# EAGLE design bq24026 USB (EAGLE 6.1)
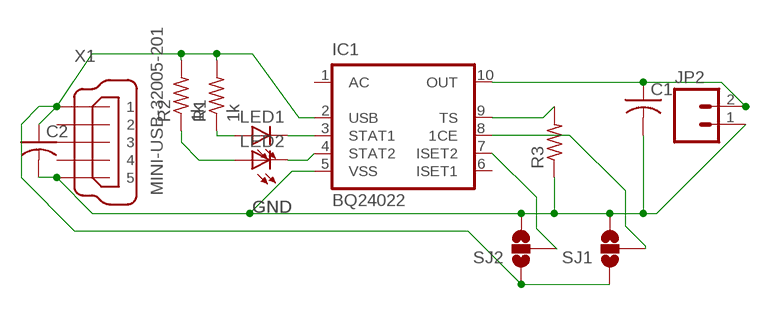
[diagram p0: schematic, sheet 1]

## Parts
C1  C-USC0805K  [C0805K]
C2  C-USC0805K  [C0805K]
IC1  BQ24022  [DRC-S-PVSON-N10]
JP2  M02  [1X02_LONGPADS]
LED1  LEDCHIPLED_0805  [CHIPLED_0805]
LED2  LEDCHIPLED_0805  [CHIPLED_0805]
R1  1k  R-US_M0805  [M0805]
R2  1k  R-US_M0805  [M0805]
R3  R-US_M1206  [M1206]
SJ1  SOLDERJUMPER_2WAYS  [SJ_3]
SJ2  SOLDERJUMPER_2WAYS  [SJ_3]
X1  MINI-USB-32005-201  [32005-201]

## Nets
GND: C1.2 C2.2 IC1.5(VSS) JP2.1 R3.1 SJ1.3 SJ2.3 X1.5
N$1: IC1.9(TS) R3.2
N$2: C2.1 IC1.2(USB) R1.2 R2.2 X1.1
N$3: LED1.A R1.1
N$4: LED2.A R2.1
N$5: IC1.3(STAT1) LED1.C
N$6: IC1.4(STAT2) LED2.C
N$7: IC1.7(ISET2) SJ2.2
N$8: C1.1 IC1.10(OUT) JP2.2
N$9: IC1.8(1CE) SJ1.2
N$10: SJ1.1 SJ2.1
Unconnected: IC1.1(AC) IC1.6(ISET1) IC1.TH X1.2 X1.3 X1.4

## Library data of the parts
C1 C2 = resistor:C-US: CAPACITOR, American symbol
IC1 = texas:BQ24022: SINGLE-CHIP, LI-ION AND LI-POL CHARGER IC WITH AUTONOMOUS USB-PORT AND AC-ADAPTER SUPPLY MANAGEMENT (bqTINY™-II) Source: bq24022.pdf (www.ti.com)
JP2 = SparkFun:M02: Header 2 Standard 2-pin 0.1" header. Use with straight break away headers (SKU : PRT-00116), right angle break away headers (PRT-00553), swiss pins (PRT-00743), machine pins (PRT-00117), and female headers (PRT-00115). Molex polarized connector foot print use with SKU : PRT-08233 with associated crimp pins and housings.
LED1 LED2 = led:LED: LED OSRAM: - CHIPLED LG R971, LG N971, LY N971, LG Q971, LY Q971, LO R971, LY R971 LH N974, LH R974 LS Q976, LO Q976, LY Q976 LO Q996 - Hyper CHIPLED LW Q18S LB Q993, LB Q99A, LB R99A - SideLED LS A670, LO A670, LY A670, LG A670, LP A670 LB A673, LV A673, LT A673, LW A673 LH A674 LY A675 LS A676, LA A676, LO A676, LY A676, LW A676 LS A679, LY A679, LG A679 - Hyper Micro SIDELED® LS Y876, LA Y876, LO Y876, LY Y876 LT Y87S - SmartLED LW L88C, LW L88S LB L89C, LB L89S, LG L890 LS L89K, LO L89K, LY L89K LS L896, LA L896, LO L896, LY L896 - TOPLED LS T670, LO T670, LY T670, LG T670, LP T670 LSG T670, LSP T670, LSY T670, LOP T670, LYG T670 LG T671, LOG T671, LSG T671 LB T673, LV T673, LT T673, LW T673 LH T674 LS T676, LA T676, LO T676, LY T676, LB T676, LH T676, LSB T676, LW T676 LB T67C, LV T67C, LT T67C, LS T67K, LO T67K, LY T67K, LW E67C LS E67B, LA E67B, LO E67B, LY E67B, LB E67C, LV E67C, LT E67C LW T67C LS T679, LY T679, LG T679 LS T770, LO T770, LY T770, LG T770, LP T770 LB T773, LV T773, LT T773, LW T773 LH T774 LS E675, LA E675, LY E675, LS T675 LS T776, LA T776, LO T776, LY T776, LB T776 LHGB T686 LT T68C, LB T68C - Hyper Mini TOPLED® LB M676 - Mini TOPLED Santana® LG M470 LS M47K, LO M47K, LY M47K Source: http://www.osram.convergy.de LUXEON: - LUMILED® LXK2-PW12-R00, LXK2-PW12-S00, LXK2-PW14-U00, LXK2-PW14-V00 LXK2-PM12-R00, LXK2-PM12-S00, LXK2-PM14-U00 LXK2-PE12-Q00, LXK2-PE12-R00, LXK2-PE12-S00, LXK2-PE14-T00, LXK2-PE14-U00 LXK2-PB12-K00, LXK2-PB12-L00, LXK2-PB12-M00, LXK2-PB14-N00, LXK2-PB14-P00, LXK2-PB14-Q00 LXK2-PR12-L00, LXK2-PR12-M00, LXK2-PR14-Q00, LXK2-PR14-R00 LXK2-PD12-Q00, LXK2-PD12-R00, LXK2-PD12-S00 LXK2-PH12-R00, LXK2-PH12-S00 LXK2-PL12-P00, LXK2-PL12-Q00, LXK2-PL12-R00 Source: www.luxeon.com KINGBRIGHT: KA-3528ASYC Source: www.kingbright.com
R1-R3 = resistor:R-US_: RESISTOR, American symbol
SJ1 SJ2 = SparkFun:SOLDERJUMPER_2WAY: Solder Jumper 2 way solder jumper
X1 = con-cypressindustries:MINI-USB-: MINI USB-B Conector Source: www.cypressindustries.com; OC_FARNELL: unknown; OC_NEWARK: unknown

## Board
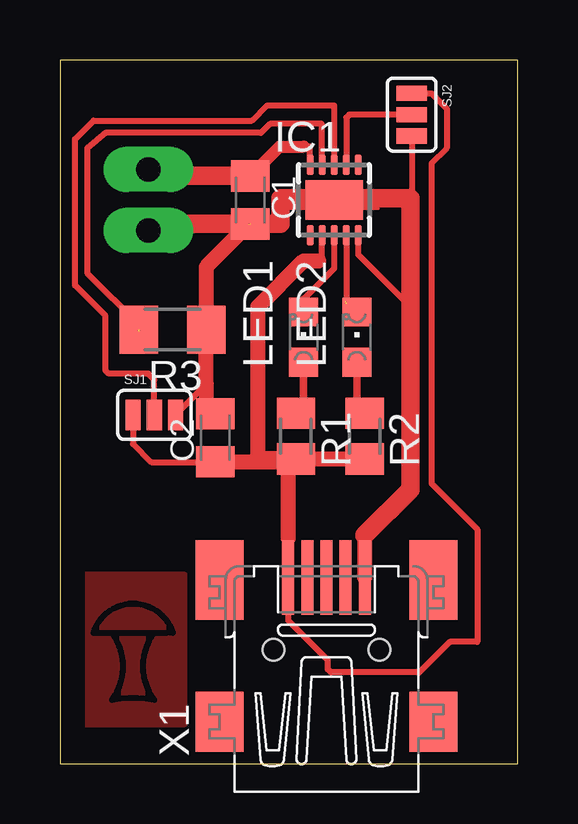
[diagram p1: board, top side]

Size 19.1 x 29.33 mm. Coordinates in mm from the lower left corner, seen from the top.
Outline: 0,0 19.1,0 19.1,29.33 0,29.33 0,0
Copper layers (1*16): Top 0.035mm / dielectric 1.5mm / Bottom 0.035mm
Design rules: minimum track width 10mil, minimum drill 24mil, track to track 8mil, track to pad 8mil, pad to pad 8mil, via to via 8mil, smd to smd 8mil, copper to edge 40mil, drill to drill 8mil, minimum pad ring 10mil, minimum via ring 8mil, stop-mask expansion 4mil, vias tented up to drill 0mil, thermal gap 10mil
tRestrict: 7 lines

### Footprints (pad centres in the part's own frame; a part is rotated, then mirrored left to right if it is on the bottom)
C0805K = smd 1.3 x 1.6: 1 -1,0; 2 1,0
DRC-S-PVSON-N10 = smd 0.28 x 0.85: 1 -1,-1.475; 2 -0.5,-1.475; 3 0,-1.475; 4 0.5,-1.475; 5 1,-1.475; 6 1,1.475; 7 0.5,1.475; 8 0,1.475; 9 -0.5,1.475; 10 -1,1.475 | smd 2.4 x 1.65: TH 0,0
1X02_LONGPADS = drill 1.016 pad 1.88 long: 1 0,0; 2 2.54,0
CHIPLED_0805 = smd 1.2 x 1.2: A 0,-1.05; C 0,1.05
M0805 = smd 1.3 x 1.6: 1 -0.95,0; 2 0.95,0
M1206 = smd 1.6 x 2: 1 -1.4,0; 2 1.4,0
SJ_3 = smd 0.635 x 1.27: 1 -0.889,0; 2 0,0; 3 0.889,0
32005-201 = smd 3.1 x 0.5: 1 3,1.6; 2 3,0.8; 3 3,0; 4 3,-0.8; 5 3,-1.6 | smd 2.5 x 2: M1 -3,-4.45; M2 -3,4.45 | smd 3.3 x 2: M3 2.9,4.45; M4 2.9,-4.45 | hole 0.9: 0,2.2; 0,-2.2

### Placement (x,y rotation side)
C1  7.94,23.5 270 top
C2  6.48,13.59 90 top
IC1  11.43,23.5 0 top
JP2  3.68,22.23 90 top
LED1  10.16,17.78 0 top
LED2  12.38,17.78 0 top
R1  9.84,13.65 270 top
R2  12.7,13.65 270 top
R3  4.7,18.1 180 top
SJ1  3.94,14.54 0 top
SJ2  14.67,27.05 270 top
X1  11.11,4.76 90 top

### Tracks (layer width: path | path; a pad name or v marks a point on that pad's centre or on a via)
GND  (1 unrouted)
  Top 0.254: IC1.5 12.43,21.23 14.61,19.05 | SJ1.3 6.1,15.81 | 6.1,18.16 6.1,20.7 7.87,22.48 | SJ2.3 14.67,23.62 14.61,23.56
  Top 0.635: X1.5 12.71,9.54 14.61,11.43 | 7.87,22.48 6.1,20.7 R3.1 | 6.1,18.16 6.1,15.81 6.1,15.11 6.48,14.73 C2.2
  Top 0.762: JP2.1 3.17,22.5 C1.2 9.21,22.5 9.21,23.56 14.61,23.56 14.61,19.05 14.61,11.43 12.7,9.53
N$1  (1 unrouted)
  Top 0.254: IC1.9 10.92,26.67 8.76,26.67 8.38,26.29 1.91,26.29 1.14,25.65 1.14,20.45 3.3,18.29 3.3,18.03
N$2
  Top 0.254: X1.1 9.51,9.4 9.51,12.2 9.4,12.32 | 10.79,20.95 10.93,21.09 IC1.2
  Top 0.635: R1.2 R2.2 | C2.1 9.73,12.59 R1.2 | R1.2 9.51,12.37 9.51,9.4 | R1.2 8.26,12.7 8.26,19.05 10.16,20.95 10.79,20.95
N$3
  Top 0.318: R1.1 10.16,14.92 LED1.A
N$4
  Top 0.318: R2.1 12.38,14.92 LED2.A
N$5
  Top 0.254: IC1.3 11.43,20.64 10.16,19.37
  Top 0.318: 10.16,19.37 LED1.C
N$6  (1 unrouted)
  Top 0.254: IC1.4 11.94,19.18
  Top 0.318: LED2.C 11.93,19.28
N$7
  Top 0.254: SJ2.2 12.06,27.05 11.94,26.92 IC1.7
N$8
  Top 0.254: IC1.10 10.43,25.72 10.16,25.72 9.21,25.72 7.94,24.45
  Top 0.508: C1.1 9.16,25.72 10.16,25.72
  Top 0.762: C1.1 3.17,24.5 JP2.2
N$9
  Top 0.254: SJ1.2 3.94,16 3.68,16.26 2.03,16.26 1.91,16.38 1.91,18.67 0.64,19.94 0.64,26.04 1.4,26.8 8,26.8 8.64,27.43 11.43,27.43 IC1.8
N$10
  Top 0.254: SJ1.1 3.05,13.34 3.81,12.57 6.48,12.57 | 9.53,9.4 9.53,5.97 11.18,4.32 11.18,3.94 11.3,3.81 14.99,3.81 16.26,5.08 17.4,5.08 17.4,9.78 15.49,11.68 15.49,25.02 16.13,25.65 16.13,27.3 15.49,27.94 SJ2.1
  Top 0.406: 6.48,12.57 9.53,12.57 9.53,9.4
N$11
  pour Top: 0.89,7.87 0.89,1.65 5.21,1.65 5.21,7.87